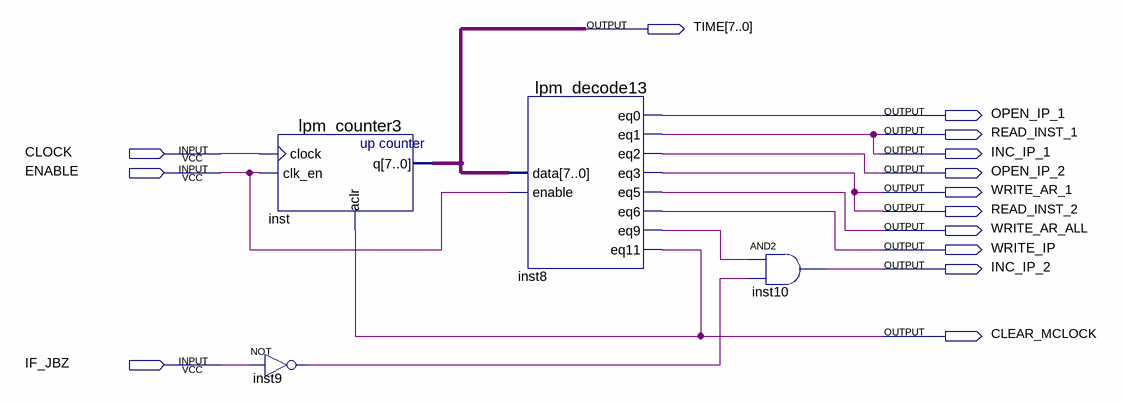
[diagram p0: schematic sheet]
// Quartus schematic JBZ.bdf as structural Verilog: 4 symbols, 14 pins
module JBZ (
  input  CLOCK,
  input  ENABLE,
  input  IF_JBZ,
  output [7:0] TIME,
  output OPEN_IP_1,
  output READ_INST_1,
  output INC_IP_1,
  output OPEN_IP_2,
  output WRITE_AR_1,
  output READ_INST_2,
  output WRITE_AR_ALL,
  output WRITE_IP,
  output INC_IP_2,
  output CLEAR_MCLOCK
);

  wire inst8_eq9, inst9_out;

  not inst9 (inst9_out, IF_JBZ);
  lpm_counter3 inst (.clock(CLOCK), .clk_en(ENABLE), .aclr(CLEAR_MCLOCK), .q(TIME));
  lpm_decode13 inst8 (
    .data(TIME), .enable(ENABLE), .eq0(OPEN_IP_1), .eq1(INC_IP_1), .eq2(OPEN_IP_2), .eq3(READ_INST_2),
    .eq5(WRITE_AR_ALL), .eq6(WRITE_IP), .eq9(inst8_eq9), .eq11(CLEAR_MCLOCK));
  and inst10 (INC_IP_2, inst8_eq9, inst9_out);

  assign READ_INST_1 = INC_IP_1;
  assign WRITE_AR_1 = READ_INST_2;
endmodule
